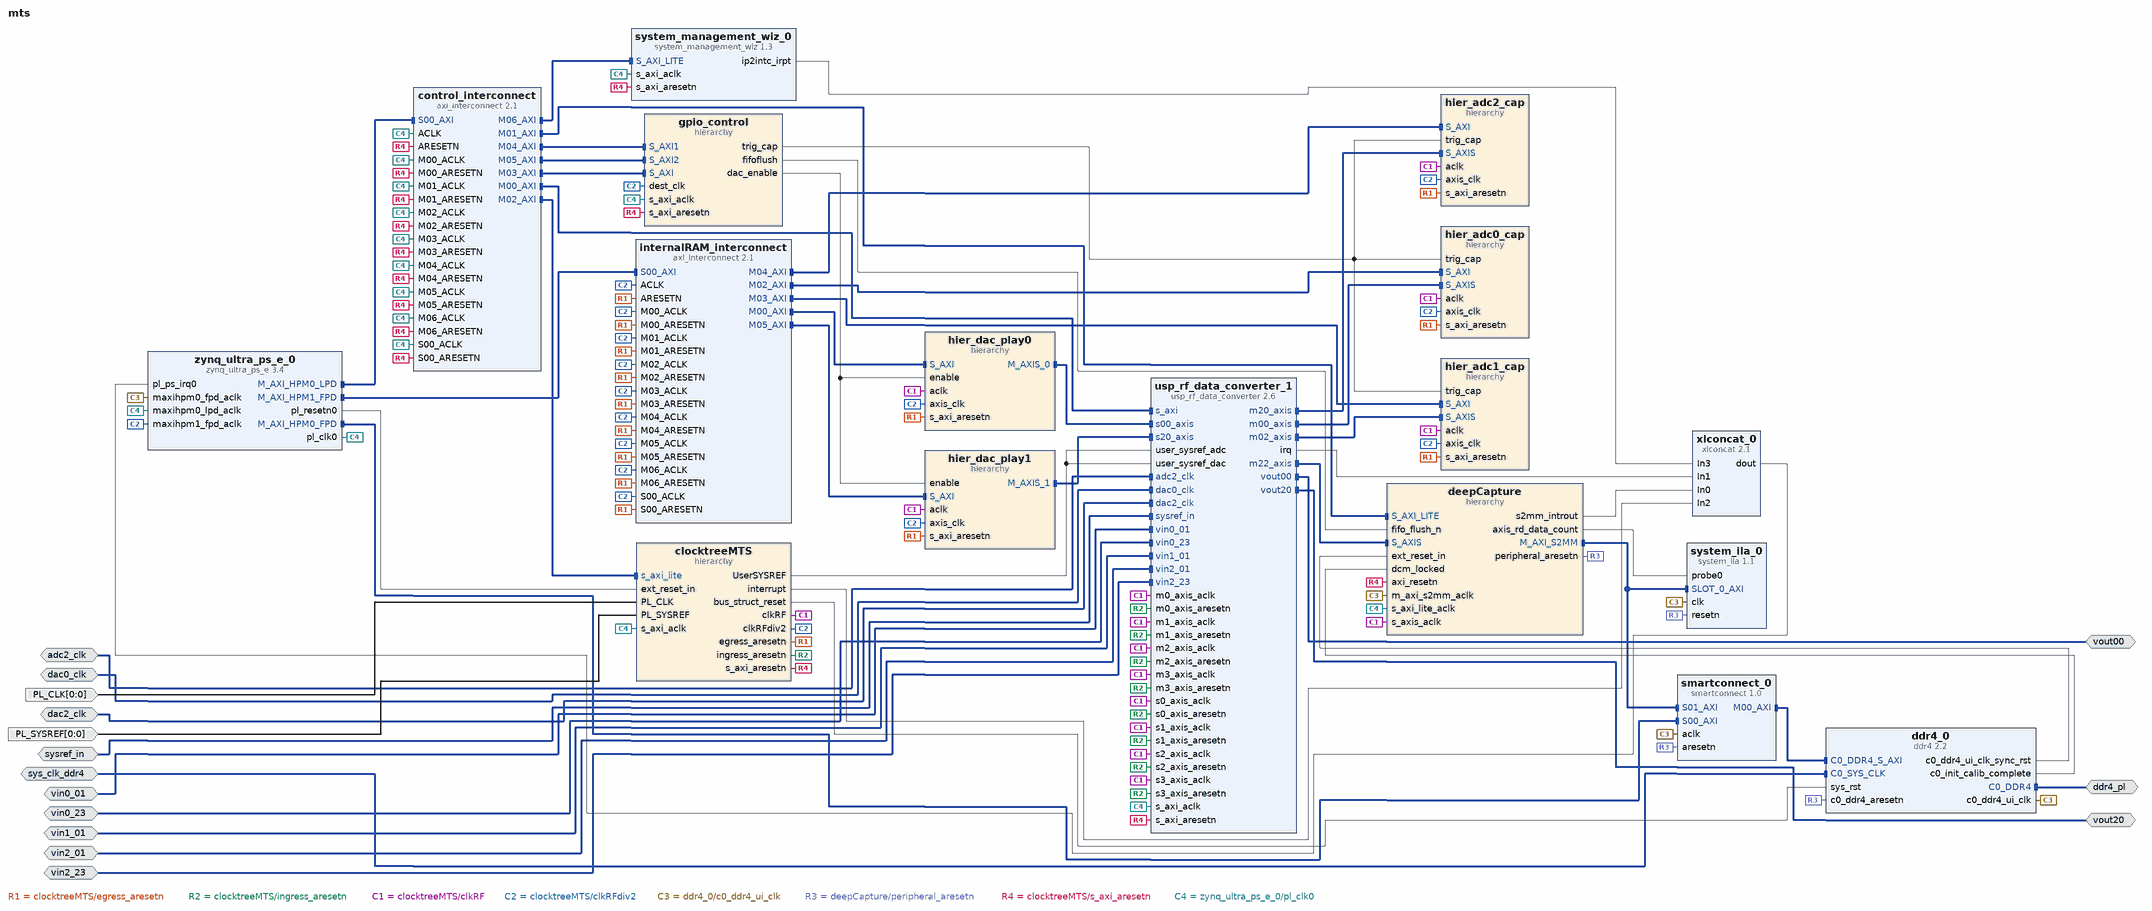
[diagram p0: block diagram of the top level]
# Vivado block design mts, xczu48dr-fsvg1517-2-e, Vivado 2022.1
create_bd_design mts

create_bd_intf_port -mode Slave -vlnv xilinx.com:interface:diff_clock_rtl:1.0 adc2_clk
create_bd_intf_port -mode Slave -vlnv xilinx.com:interface:diff_clock_rtl:1.0 dac2_clk
create_bd_intf_port -mode Master -vlnv xilinx.com:interface:ddr4_rtl:1.0 ddr4_pl
create_bd_intf_port -mode Slave -vlnv xilinx.com:interface:diff_clock_rtl:1.0 sys_clk_ddr4
set_property -dict {CONFIG.FREQ_HZ 200000000} [get_bd_intf_ports sys_clk_ddr4]
create_bd_intf_port -mode Slave -vlnv xilinx.com:display_usp_rf_data_converter:diff_pins_rtl:1.0 sysref_in
create_bd_intf_port -mode Slave -vlnv xilinx.com:interface:diff_analog_io_rtl:1.0 vin0_01
create_bd_intf_port -mode Slave -vlnv xilinx.com:interface:diff_analog_io_rtl:1.0 vin0_23
create_bd_intf_port -mode Slave -vlnv xilinx.com:interface:diff_analog_io_rtl:1.0 vin1_01
create_bd_intf_port -mode Slave -vlnv xilinx.com:interface:diff_analog_io_rtl:1.0 vin2_01
create_bd_intf_port -mode Slave -vlnv xilinx.com:interface:diff_analog_io_rtl:1.0 vin2_23
create_bd_intf_port -mode Master -vlnv xilinx.com:interface:diff_analog_io_rtl:1.0 vout00
create_bd_intf_port -mode Master -vlnv xilinx.com:interface:diff_analog_io_rtl:1.0 vout20
create_bd_intf_port -mode Slave -vlnv xilinx.com:interface:diff_clock_rtl:1.0 dac0_clk
create_bd_port -dir I -from 0 -to 0 -type clk PL_CLK
set_property -dict {CONFIG.FREQ_HZ 500000000} [get_bd_ports PL_CLK]
create_bd_port -dir I -from 0 -to 0 PL_SYSREF

create_bd_cell -type hier clocktreeMTS
create_bd_cell -type ip -vlnv xilinx.com:ip:axi_interconnect:2.1 control_interconnect
set_property -dict [list \
  CONFIG.NUM_MI 7 \
  CONFIG.S00_HAS_DATA_FIFO 0 \
  CONFIG.S00_HAS_REGSLICE 3 \
  CONFIG.STRATEGY 1 \
] [get_bd_cells control_interconnect]
create_bd_cell -type ip -vlnv xilinx.com:ip:ddr4:2.2 ddr4_0
set_property -dict [list \
  CONFIG.C0.BANK_GROUP_WIDTH 1 \
  CONFIG.C0.DDR4_AxiAddressWidth 32 \
  CONFIG.C0.DDR4_AxiDataWidth 512 \
  CONFIG.C0.DDR4_CasLatency 19 \
  CONFIG.C0.DDR4_CasWriteLatency 14 \
  CONFIG.C0.DDR4_DataWidth 64 \
  CONFIG.C0.DDR4_InputClockPeriod 5000 \
  CONFIG.C0.DDR4_MemoryPart MT40A512M16LY-075 \
  CONFIG.C0.DDR4_TimePeriod 750 \
  CONFIG.C0.DDR4_isCustom false \
] [get_bd_cells ddr4_0]
create_bd_cell -type hier deepCapture
create_bd_cell -type hier gpio_control
create_bd_cell -type hier hier_adc0_cap
create_bd_cell -type hier hier_adc1_cap
create_bd_cell -type hier hier_adc2_cap
create_bd_cell -type hier hier_dac_play0
create_bd_cell -type ip -vlnv xilinx.com:ip:axi_interconnect:2.1 internalRAM_interconnect
set_property -dict [list \
  CONFIG.ENABLE_ADVANCED_OPTIONS 0 \
  CONFIG.M00_HAS_DATA_FIFO 0 \
  CONFIG.M00_HAS_REGSLICE 3 \
  CONFIG.M01_HAS_DATA_FIFO 0 \
  CONFIG.M01_HAS_REGSLICE 3 \
  CONFIG.M02_HAS_DATA_FIFO 0 \
  CONFIG.M02_HAS_REGSLICE 3 \
  CONFIG.M03_HAS_DATA_FIFO 0 \
  CONFIG.M03_HAS_REGSLICE 3 \
  CONFIG.M04_HAS_DATA_FIFO 0 \
  CONFIG.M04_HAS_REGSLICE 3 \
  CONFIG.NUM_MI 7 \
  CONFIG.S00_HAS_DATA_FIFO 0 \
  CONFIG.S00_HAS_REGSLICE 3 \
  CONFIG.STRATEGY 1 \
] [get_bd_cells internalRAM_interconnect]
create_bd_cell -type ip -vlnv xilinx.com:ip:smartconnect:1.0 smartconnect_0
create_bd_cell -type ip -vlnv xilinx.com:ip:system_ila:1.1 system_ila_0
set_property -dict [list \
  CONFIG.ALL_PROBE_SAME_MU_CNT 2 \
  CONFIG.C_EN_STRG_QUAL 1 \
  CONFIG.C_MON_TYPE MIX \
  CONFIG.C_PROBE0_MU_CNT 2 \
  CONFIG.C_PROBE0_TYPE 1 \
  CONFIG.C_SLOT_0_APC_EN 1 \
] [get_bd_cells system_ila_0]
create_bd_cell -type ip -vlnv xilinx.com:ip:system_management_wiz:1.3 system_management_wiz_0
set_property -dict [list \
  CONFIG.AVERAGE_ENABLE_TEMPERATURE true \
  CONFIG.AVERAGE_ENABLE_VBRAM true \
  CONFIG.AVERAGE_ENABLE_VCCAUX true \
  CONFIG.AVERAGE_ENABLE_VCCINT true \
  CONFIG.AVERAGE_ENABLE_VCCPSAUX true \
  CONFIG.AVERAGE_ENABLE_VCCPSINTFP true \
  CONFIG.AVERAGE_ENABLE_VCCPSINTLP true \
  CONFIG.CHANNEL_AVERAGING 256 \
  CONFIG.CHANNEL_ENABLE_VCCPSAUX true \
  CONFIG.CHANNEL_ENABLE_VCCPSINTFP true \
  CONFIG.CHANNEL_ENABLE_VCCPSINTLP true \
  CONFIG.CHANNEL_ENABLE_VREFN true \
  CONFIG.CHANNEL_ENABLE_VREFP true \
  CONFIG.ENABLE_VCCPSAUX_ALARM false \
  CONFIG.ENABLE_VCCPSINTFP_ALARM false \
  CONFIG.ENABLE_VCCPSINTLP_ALARM false \
  CONFIG.OT_ALARM false \
  CONFIG.USER_TEMP_ALARM false \
  CONFIG.VCCAUX_ALARM false \
  CONFIG.VCCINT_ALARM false \
] [get_bd_cells system_management_wiz_0]
create_bd_cell -type ip -vlnv xilinx.com:ip:usp_rf_data_converter:2.6 usp_rf_data_converter_1
set_property -dict [list \
  CONFIG.ADC0_Clock_Dist 0 \
  CONFIG.ADC0_Clock_Source 2 \
  CONFIG.ADC0_Multi_Tile_Sync true \
  CONFIG.ADC0_Outclk_Freq 250.000 \
  CONFIG.ADC0_PLL_Enable false \
  CONFIG.ADC0_Refclk_Freq 4000.000 \
  CONFIG.ADC0_Sampling_Rate 4.0 \
  CONFIG.ADC1_Clock_Dist 0 \
  CONFIG.ADC1_Clock_Source 2 \
  CONFIG.ADC1_Multi_Tile_Sync true \
  CONFIG.ADC1_Outclk_Freq 250.000 \
  CONFIG.ADC1_PLL_Enable false \
  CONFIG.ADC1_Refclk_Freq 4000.000 \
  CONFIG.ADC1_Sampling_Rate 4.0 \
  CONFIG.ADC2_Clock_Dist 2 \
  CONFIG.ADC2_Clock_Source 2 \
  CONFIG.ADC2_Multi_Tile_Sync true \
  CONFIG.ADC2_Outclk_Freq 250.000 \
  CONFIG.ADC2_PLL_Enable true \
  CONFIG.ADC2_Refclk_Freq 500.000 \
  CONFIG.ADC2_Sampling_Rate 4.0 \
  CONFIG.ADC3_Clock_Source 2 \
  CONFIG.ADC3_Outclk_Freq 250.000 \
  CONFIG.ADC3_PLL_Enable false \
  CONFIG.ADC3_Refclk_Freq 4000.000 \
  CONFIG.ADC3_Sampling_Rate 4.0 \
  CONFIG.ADC_Coarse_Mixer_Freq02 3 \
  CONFIG.ADC_Coarse_Mixer_Freq10 3 \
  CONFIG.ADC_Coarse_Mixer_Freq20 3 \
  CONFIG.ADC_Coarse_Mixer_Freq22 3 \
  CONFIG.ADC_Coarse_Mixer_Freq30 3 \
  CONFIG.ADC_Data_Width00 8 \
  CONFIG.ADC_Data_Width02 8 \
  CONFIG.ADC_Data_Width10 8 \
  CONFIG.ADC_Data_Width20 8 \
  CONFIG.ADC_Data_Width22 8 \
  CONFIG.ADC_Data_Width30 8 \
  CONFIG.ADC_Decimation_Mode00 1 \
  CONFIG.ADC_Decimation_Mode02 1 \
  CONFIG.ADC_Decimation_Mode10 1 \
  CONFIG.ADC_Decimation_Mode20 1 \
  CONFIG.ADC_Decimation_Mode22 1 \
  CONFIG.ADC_Decimation_Mode30 1 \
  CONFIG.ADC_Dither00 true \
  CONFIG.ADC_Dither10 true \
  CONFIG.ADC_Dither20 true \
  CONFIG.ADC_Dither30 true \
  CONFIG.ADC_Mixer_Type00 1 \
  CONFIG.ADC_Mixer_Type02 1 \
  CONFIG.ADC_Mixer_Type10 1 \
  CONFIG.ADC_Mixer_Type20 1 \
  CONFIG.ADC_Mixer_Type22 1 \
  CONFIG.ADC_Mixer_Type30 1 \
  CONFIG.ADC_OBS02 false \
  CONFIG.ADC_OBS22 false \
  CONFIG.ADC_RTS false \
  CONFIG.ADC_Slice00_Enable true \
  CONFIG.ADC_Slice02_Enable true \
  CONFIG.ADC_Slice10_Enable true \
  CONFIG.ADC_Slice12_Enable false \
  CONFIG.ADC_Slice20_Enable true \
  CONFIG.ADC_Slice22_Enable true \
  CONFIG.ADC_Slice30_Enable true \
  CONFIG.Axiclk_Freq 100.0 \
  CONFIG.DAC0_Clock_Dist 2 \
  CONFIG.DAC0_Clock_Source 4 \
  CONFIG.DAC0_Link_Coupling 1 \
  CONFIG.DAC0_Multi_Tile_Sync true \
  CONFIG.DAC0_Outclk_Freq 250.000 \
  CONFIG.DAC0_PLL_Enable true \
  CONFIG.DAC0_Refclk_Freq 250.000 \
  CONFIG.DAC0_Sampling_Rate 4 \
  CONFIG.DAC1_Clock_Source 6 \
  CONFIG.DAC1_Link_Coupling 1 \
  CONFIG.DAC1_Multi_Tile_Sync true \
  CONFIG.DAC1_Outclk_Freq 250.000 \
  CONFIG.DAC1_PLL_Enable false \
  CONFIG.DAC1_Refclk_Freq 4000.000 \
  CONFIG.DAC1_Sampling_Rate 4 \
  CONFIG.DAC2_Clock_Dist 2 \
  CONFIG.DAC2_Link_Coupling 1 \
  CONFIG.DAC2_Multi_Tile_Sync true \
  CONFIG.DAC2_Outclk_Freq 250.000 \
  CONFIG.DAC2_PLL_Enable true \
  CONFIG.DAC2_Refclk_Freq 250.000 \
  CONFIG.DAC2_Sampling_Rate 4 \
  CONFIG.DAC3_Clock_Source 6 \
  CONFIG.DAC3_Link_Coupling 1 \
  CONFIG.DAC3_Multi_Tile_Sync false \
  CONFIG.DAC3_Outclk_Freq 250.000 \
  CONFIG.DAC3_PLL_Enable false \
  CONFIG.DAC3_Refclk_Freq 4000.000 \
  CONFIG.DAC3_Sampling_Rate 4 \
  CONFIG.DAC_Coarse_Mixer_Freq00 3 \
  CONFIG.DAC_Coarse_Mixer_Freq10 3 \
  CONFIG.DAC_Coarse_Mixer_Freq20 3 \
  CONFIG.DAC_Coarse_Mixer_Freq30 3 \
  CONFIG.DAC_Data_Width00 8 \
  CONFIG.DAC_Data_Width10 8 \
  CONFIG.DAC_Data_Width20 8 \
  CONFIG.DAC_Data_Width30 8 \
  CONFIG.DAC_Interpolation_Mode00 1 \
  CONFIG.DAC_Interpolation_Mode10 1 \
  CONFIG.DAC_Interpolation_Mode20 1 \
  CONFIG.DAC_Interpolation_Mode30 1 \
  CONFIG.DAC_Mixer_Mode00 2 \
  CONFIG.DAC_Mixer_Type00 1 \
  CONFIG.DAC_Mixer_Type10 1 \
  CONFIG.DAC_Mixer_Type20 1 \
  CONFIG.DAC_Mixer_Type30 1 \
  CONFIG.DAC_Output_Current 0 \
  CONFIG.DAC_Slice00_Enable true \
  CONFIG.DAC_Slice02_Enable false \
  CONFIG.DAC_Slice10_Enable true \
  CONFIG.DAC_Slice12_Enable false \
  CONFIG.DAC_Slice20_Enable true \
  CONFIG.DAC_Slice22_Enable false \
  CONFIG.DAC_Slice30_Enable true \
  CONFIG.DAC_Slice32_Enable false \
  CONFIG.DAC_VOP_Mode 0 \
  CONFIG.RF_Analyzer 1 \
] [get_bd_cells usp_rf_data_converter_1]
create_bd_cell -type ip -vlnv xilinx.com:ip:xlconcat:2.1 xlconcat_0
set_property -dict {CONFIG.NUM_PORTS 4} [get_bd_cells xlconcat_0]
create_bd_cell -type ip -vlnv xilinx.com:ip:zynq_ultra_ps_e:3.4 zynq_ultra_ps_e_0
set_property -dict [list \
  CONFIG.CAN0_BOARD_INTERFACE custom \
  CONFIG.CAN1_BOARD_INTERFACE custom \
  CONFIG.CSU_BOARD_INTERFACE custom \
  CONFIG.DP_BOARD_INTERFACE custom \
  CONFIG.GEM0_BOARD_INTERFACE custom \
  CONFIG.GEM1_BOARD_INTERFACE custom \
  CONFIG.GEM2_BOARD_INTERFACE custom \
  CONFIG.GEM3_BOARD_INTERFACE custom \
  CONFIG.GPIO_BOARD_INTERFACE custom \
  CONFIG.IIC0_BOARD_INTERFACE custom \
  CONFIG.IIC1_BOARD_INTERFACE custom \
  CONFIG.NAND_BOARD_INTERFACE custom \
  CONFIG.PCIE_BOARD_INTERFACE custom \
  CONFIG.PJTAG_BOARD_INTERFACE custom \
  CONFIG.PMU_BOARD_INTERFACE custom \
  CONFIG.PSU_BANK_0_IO_STANDARD LVCMOS18 \
  CONFIG.PSU_BANK_1_IO_STANDARD LVCMOS18 \
  CONFIG.PSU_BANK_2_IO_STANDARD LVCMOS18 \
  CONFIG.PSU_BANK_3_IO_STANDARD LVCMOS33 \
  CONFIG.PSU_USB3__DUAL_CLOCK_ENABLE 1 \
  CONFIG.PSU__CAN1__PERIPHERAL__ENABLE 0 \
  CONFIG.PSU__CRF_APB__ACPU_CTRL__FREQMHZ 1200 \
  CONFIG.PSU__CRF_APB__ACPU_CTRL__SRCSEL APLL \
  CONFIG.PSU__CRF_APB__APLL_CTRL__SRCSEL PSS_REF_CLK \
  CONFIG.PSU__CRF_APB__DBG_FPD_CTRL__FREQMHZ 250 \
  CONFIG.PSU__CRF_APB__DBG_FPD_CTRL__SRCSEL IOPLL \
  CONFIG.PSU__CRF_APB__DBG_TRACE_CTRL__FREQMHZ 250 \
  CONFIG.PSU__CRF_APB__DBG_TRACE_CTRL__SRCSEL IOPLL \
  CONFIG.PSU__CRF_APB__DBG_TSTMP_CTRL__FREQMHZ 250 \
  CONFIG.PSU__CRF_APB__DBG_TSTMP_CTRL__SRCSEL IOPLL \
  CONFIG.PSU__CRF_APB__DDR_CTRL__FREQMHZ 1067 \
  CONFIG.PSU__CRF_APB__DDR_CTRL__SRCSEL DPLL \
  CONFIG.PSU__CRF_APB__DPDMA_REF_CTRL__FREQMHZ 600 \
  CONFIG.PSU__CRF_APB__DPDMA_REF_CTRL__SRCSEL APLL \
  CONFIG.PSU__CRF_APB__DPLL_CTRL__SRCSEL PSS_REF_CLK \
  CONFIG.PSU__CRF_APB__DP_AUDIO_REF_CTRL__SRCSEL RPLL \
  CONFIG.PSU__CRF_APB__DP_STC_REF_CTRL__SRCSEL RPLL \
  CONFIG.PSU__CRF_APB__DP_VIDEO_REF_CTRL__SRCSEL VPLL \
  CONFIG.PSU__CRF_APB__GDMA_REF_CTRL__FREQMHZ 600 \
  CONFIG.PSU__CRF_APB__GDMA_REF_CTRL__SRCSEL APLL \
  CONFIG.PSU__CRF_APB__GPU_REF_CTRL__FREQMHZ 500 \
  CONFIG.PSU__CRF_APB__GPU_REF_CTRL__SRCSEL IOPLL \
  CONFIG.PSU__CRF_APB__TOPSW_LSBUS_CTRL__FREQMHZ 100 \
  CONFIG.PSU__CRF_APB__TOPSW_LSBUS_CTRL__SRCSEL IOPLL \
  CONFIG.PSU__CRF_APB__TOPSW_MAIN_CTRL__FREQMHZ 533.33 \
  CONFIG.PSU__CRF_APB__TOPSW_MAIN_CTRL__SRCSEL DPLL \
  CONFIG.PSU__CRF_APB__VPLL_CTRL__SRCSEL PSS_REF_CLK \
  CONFIG.PSU__CRL_APB__ADMA_REF_CTRL__FREQMHZ 500 \
  CONFIG.PSU__CRL_APB__ADMA_REF_CTRL__SRCSEL IOPLL \
  CONFIG.PSU__CRL_APB__CAN1_REF_CTRL__FREQMHZ 100 \
  CONFIG.PSU__CRL_APB__CAN1_REF_CTRL__SRCSEL IOPLL \
  CONFIG.PSU__CRL_APB__CPU_R5_CTRL__FREQMHZ 500 \
  CONFIG.PSU__CRL_APB__CPU_R5_CTRL__SRCSEL IOPLL \
  CONFIG.PSU__CRL_APB__DBG_LPD_CTRL__FREQMHZ 250 \
  CONFIG.PSU__CRL_APB__DBG_LPD_CTRL__SRCSEL IOPLL \
  CONFIG.PSU__CRL_APB__GEM3_REF_CTRL__FREQMHZ 125 \
  CONFIG.PSU__CRL_APB__GEM3_REF_CTRL__SRCSEL IOPLL \
  CONFIG.PSU__CRL_APB__I2C0_REF_CTRL__FREQMHZ 100 \
  CONFIG.PSU__CRL_APB__I2C0_REF_CTRL__SRCSEL IOPLL \
  CONFIG.PSU__CRL_APB__I2C1_REF_CTRL__FREQMHZ 100 \
  CONFIG.PSU__CRL_APB__I2C1_REF_CTRL__SRCSEL IOPLL \
  CONFIG.PSU__CRL_APB__IOPLL_CTRL__SRCSEL PSS_REF_CLK \
  CONFIG.PSU__CRL_APB__IOU_SWITCH_CTRL__FREQMHZ 250 \
  CONFIG.PSU__CRL_APB__IOU_SWITCH_CTRL__SRCSEL IOPLL \
  CONFIG.PSU__CRL_APB__LPD_LSBUS_CTRL__FREQMHZ 100 \
  CONFIG.PSU__CRL_APB__LPD_LSBUS_CTRL__SRCSEL IOPLL \
  CONFIG.PSU__CRL_APB__LPD_SWITCH_CTRL__FREQMHZ 500 \
  CONFIG.PSU__CRL_APB__LPD_SWITCH_CTRL__SRCSEL IOPLL \
  CONFIG.PSU__CRL_APB__PCAP_CTRL__FREQMHZ 200 \
  CONFIG.PSU__CRL_APB__PCAP_CTRL__SRCSEL IOPLL \
  CONFIG.PSU__CRL_APB__PL0_REF_CTRL__FREQMHZ 100 \
  CONFIG.PSU__CRL_APB__PL0_REF_CTRL__SRCSEL IOPLL \
  CONFIG.PSU__CRL_APB__QSPI_REF_CTRL__FREQMHZ 125 \
  CONFIG.PSU__CRL_APB__QSPI_REF_CTRL__SRCSEL IOPLL \
  CONFIG.PSU__CRL_APB__RPLL_CTRL__SRCSEL PSS_REF_CLK \
  CONFIG.PSU__CRL_APB__SDIO1_REF_CTRL__FREQMHZ 200 \
  CONFIG.PSU__CRL_APB__SDIO1_REF_CTRL__SRCSEL IOPLL \
  CONFIG.PSU__CRL_APB__TIMESTAMP_REF_CTRL__FREQMHZ 100 \
  CONFIG.PSU__CRL_APB__TIMESTAMP_REF_CTRL__SRCSEL IOPLL \
  CONFIG.PSU__CRL_APB__UART0_REF_CTRL__FREQMHZ 100 \
  CONFIG.PSU__CRL_APB__UART0_REF_CTRL__SRCSEL IOPLL \
  CONFIG.PSU__CRL_APB__UART1_REF_CTRL__FREQMHZ 100 \
  CONFIG.PSU__CRL_APB__UART1_REF_CTRL__SRCSEL IOPLL \
  CONFIG.PSU__CRL_APB__USB0_BUS_REF_CTRL__FREQMHZ 250 \
  CONFIG.PSU__CRL_APB__USB0_BUS_REF_CTRL__SRCSEL IOPLL \
  CONFIG.PSU__CRL_APB__USB3_DUAL_REF_CTRL__FREQMHZ 20 \
  CONFIG.PSU__CRL_APB__USB3_DUAL_REF_CTRL__SRCSEL IOPLL \
  CONFIG.PSU__CRL_APB__USB3__ENABLE 1 \
  CONFIG.PSU__CSUPMU__PERIPHERAL__VALID 1 \
  CONFIG.PSU__DDRC__BUS_WIDTH {64 Bit} \
  CONFIG.PSU__DDRC__COMPONENTS UDIMM \
  CONFIG.PSU__DDRC__DEVICE_CAPACITY {8192 MBits} \
  CONFIG.PSU__DDRC__DRAM_WIDTH {16 Bits} \
  CONFIG.PSU__DDRC__ECC Disabled \
  CONFIG.PSU__DDRC__MEMORY_TYPE {DDR 4} \
  CONFIG.PSU__DDRC__SPEED_BIN DDR4_2133P \
  CONFIG.PSU__DDR_HIGH_ADDRESS_GUI_ENABLE 1 \
  CONFIG.PSU__DDR__INTERFACE__FREQMHZ 533.500 \
  CONFIG.PSU__DEVICE_TYPE RFSOC \
  CONFIG.PSU__DISPLAYPORT__LANE0__ENABLE 1 \
  CONFIG.PSU__DISPLAYPORT__LANE0__IO {GT Lane1} \
  CONFIG.PSU__DISPLAYPORT__LANE1__ENABLE 1 \
  CONFIG.PSU__DISPLAYPORT__LANE1__IO {GT Lane0} \
  CONFIG.PSU__DISPLAYPORT__PERIPHERAL__ENABLE 1 \
  CONFIG.PSU__DLL__ISUSED 1 \
  CONFIG.PSU__DPAUX__PERIPHERAL__ENABLE 1 \
  CONFIG.PSU__DPAUX__PERIPHERAL__IO {MIO 27 .. 30} \
  CONFIG.PSU__DP__LANE_SEL {Dual Lower} \
  CONFIG.PSU__DP__REF_CLK_FREQ 27 \
  CONFIG.PSU__DP__REF_CLK_SEL {Ref Clk1} \
  CONFIG.PSU__ENET3__FIFO__ENABLE 0 \
  CONFIG.PSU__ENET3__GRP_MDIO__ENABLE 1 \
  CONFIG.PSU__ENET3__GRP_MDIO__IO {MIO 76 .. 77} \
  CONFIG.PSU__ENET3__PERIPHERAL__ENABLE 1 \
  CONFIG.PSU__ENET3__PERIPHERAL__IO {MIO 64 .. 75} \
  CONFIG.PSU__ENET3__PTP__ENABLE 0 \
  CONFIG.PSU__ENET3__TSU__ENABLE 0 \
  CONFIG.PSU__FPGA_PL0_ENABLE 1 \
  CONFIG.PSU__GEM3_COHERENCY 0 \
  CONFIG.PSU__GEM3_ROUTE_THROUGH_FPD 0 \
  CONFIG.PSU__GEM__TSU__ENABLE 0 \
  CONFIG.PSU__GPIO0_MIO__IO {MIO 0 .. 25} \
  CONFIG.PSU__GPIO0_MIO__PERIPHERAL__ENABLE 1 \
  CONFIG.PSU__GPIO1_MIO__IO {MIO 26 .. 51} \
  CONFIG.PSU__GPIO1_MIO__PERIPHERAL__ENABLE 1 \
  CONFIG.PSU__GPU_PP0__POWER__ON 0 \
  CONFIG.PSU__GPU_PP1__POWER__ON 0 \
  CONFIG.PSU__GT__LINK_SPEED HBR \
  CONFIG.PSU__GT__PRE_EMPH_LVL_4 0 \
  CONFIG.PSU__GT__VLT_SWNG_LVL_4 0 \
  CONFIG.PSU__I2C0__PERIPHERAL__ENABLE 1 \
  CONFIG.PSU__I2C0__PERIPHERAL__IO {MIO 14 .. 15} \
  CONFIG.PSU__I2C1__PERIPHERAL__ENABLE 1 \
  CONFIG.PSU__I2C1__PERIPHERAL__IO {MIO 16 .. 17} \
  CONFIG.PSU__IOU_SLCR__IOU_TTC_APB_CLK__TTC0_SEL APB \
  CONFIG.PSU__IOU_SLCR__IOU_TTC_APB_CLK__TTC1_SEL APB \
  CONFIG.PSU__IOU_SLCR__IOU_TTC_APB_CLK__TTC2_SEL APB \
  CONFIG.PSU__IOU_SLCR__IOU_TTC_APB_CLK__TTC3_SEL APB \
  CONFIG.PSU__MAXIGP0__DATA_WIDTH 128 \
  CONFIG.PSU__OVERRIDE_HPX_QOS 0 \
  CONFIG.PSU__OVERRIDE__BASIC_CLOCK 0 \
  CONFIG.PSU__PMU_COHERENCY 0 \
  CONFIG.PSU__PMU__AIBACK__ENABLE 0 \
  CONFIG.PSU__PMU__EMIO_GPI__ENABLE 0 \
  CONFIG.PSU__PMU__EMIO_GPO__ENABLE 0 \
  CONFIG.PSU__PMU__GPI0__ENABLE 0 \
  CONFIG.PSU__PMU__GPI1__ENABLE 0 \
  CONFIG.PSU__PMU__GPI2__ENABLE 0 \
  CONFIG.PSU__PMU__GPI3__ENABLE 0 \
  CONFIG.PSU__PMU__GPI4__ENABLE 0 \
  CONFIG.PSU__PMU__GPI5__ENABLE 0 \
  CONFIG.PSU__PMU__GPO0__ENABLE 1 \
  CONFIG.PSU__PMU__GPO0__IO {MIO 32} \
  CONFIG.PSU__PMU__GPO1__ENABLE 1 \
  CONFIG.PSU__PMU__GPO1__IO {MIO 33} \
  CONFIG.PSU__PMU__GPO2__ENABLE 1 \
  CONFIG.PSU__PMU__GPO2__IO {MIO 34} \
  CONFIG.PSU__PMU__GPO2__POLARITY low \
  CONFIG.PSU__PMU__GPO3__ENABLE 1 \
  CONFIG.PSU__PMU__GPO3__IO {MIO 35} \
  CONFIG.PSU__PMU__GPO3__POLARITY low \
  CONFIG.PSU__PMU__GPO4__ENABLE 1 \
  CONFIG.PSU__PMU__GPO4__IO {MIO 36} \
  CONFIG.PSU__PMU__GPO4__POLARITY low \
  CONFIG.PSU__PMU__GPO5__ENABLE 1 \
  CONFIG.PSU__PMU__GPO5__IO {MIO 37} \
  CONFIG.PSU__PMU__GPO5__POLARITY low \
  CONFIG.PSU__PMU__PERIPHERAL__ENABLE 1 \
  CONFIG.PSU__PMU__PLERROR__ENABLE 0 \
  CONFIG.PSU__PRESET_APPLIED 1 \
  CONFIG.PSU__PSS_REF_CLK__FREQMHZ 33.33333333333333333333333333333333333333333333333333 \
  CONFIG.PSU__QSPI_COHERENCY 0 \
  CONFIG.PSU__QSPI_ROUTE_THROUGH_FPD 0 \
  CONFIG.PSU__QSPI__GRP_FBCLK__ENABLE 1 \
  CONFIG.PSU__QSPI__GRP_FBCLK__IO {MIO 6} \
  CONFIG.PSU__QSPI__PERIPHERAL__DATA_MODE x4 \
  CONFIG.PSU__QSPI__PERIPHERAL__ENABLE 1 \
  CONFIG.PSU__QSPI__PERIPHERAL__IO {MIO 0 .. 12} \
  CONFIG.PSU__QSPI__PERIPHERAL__MODE {Dual Parallel} \
  CONFIG.PSU__SATA__LANE1__IO {GT Lane3} \
  CONFIG.PSU__SATA__PERIPHERAL__ENABLE 1 \
  CONFIG.PSU__SATA__REF_CLK_FREQ 125 \
  CONFIG.PSU__SATA__REF_CLK_SEL {Ref Clk3} \
  CONFIG.PSU__SD0__CLK_100_SDR_OTAP_DLY 0x3 \
  CONFIG.PSU__SD0__CLK_200_SDR_OTAP_DLY 0x3 \
  CONFIG.PSU__SD0__CLK_50_DDR_ITAP_DLY 0x3D \
  CONFIG.PSU__SD0__CLK_50_DDR_OTAP_DLY 0x4 \
  CONFIG.PSU__SD0__CLK_50_SDR_ITAP_DLY 0x15 \
  CONFIG.PSU__SD0__CLK_50_SDR_OTAP_DLY 0x5 \
  CONFIG.PSU__SD1_COHERENCY 0 \
  CONFIG.PSU__SD1_ROUTE_THROUGH_FPD 0 \
  CONFIG.PSU__SD1__CLK_100_SDR_OTAP_DLY 0x3 \
  CONFIG.PSU__SD1__CLK_200_SDR_OTAP_DLY 0x3 \
  CONFIG.PSU__SD1__CLK_50_DDR_ITAP_DLY 0x3D \
  CONFIG.PSU__SD1__CLK_50_DDR_OTAP_DLY 0x4 \
  CONFIG.PSU__SD1__CLK_50_SDR_ITAP_DLY 0x15 \
  CONFIG.PSU__SD1__CLK_50_SDR_OTAP_DLY 0x5 \
  CONFIG.PSU__SD1__DATA_TRANSFER_MODE 8Bit \
  CONFIG.PSU__SD1__GRP_CD__ENABLE 1 \
  CONFIG.PSU__SD1__GRP_CD__IO {MIO 45} \
  CONFIG.PSU__SD1__GRP_POW__ENABLE 0 \
  CONFIG.PSU__SD1__GRP_WP__ENABLE 0 \
  CONFIG.PSU__SD1__PERIPHERAL__ENABLE 1 \
  CONFIG.PSU__SD1__PERIPHERAL__IO {MIO 39 .. 51} \
  CONFIG.PSU__SD1__SLOT_TYPE {SD 3.0} \
  CONFIG.PSU__SWDT0__CLOCK__ENABLE 0 \
  CONFIG.PSU__SWDT0__PERIPHERAL__ENABLE 1 \
  CONFIG.PSU__SWDT0__RESET__ENABLE 0 \
  CONFIG.PSU__SWDT1__CLOCK__ENABLE 0 \
  CONFIG.PSU__SWDT1__PERIPHERAL__ENABLE 1 \
  CONFIG.PSU__SWDT1__RESET__ENABLE 0 \
  CONFIG.PSU__TSU__BUFG_PORT_PAIR 0 \
  CONFIG.PSU__TTC0__CLOCK__ENABLE 0 \
  CONFIG.PSU__TTC0__PERIPHERAL__ENABLE 1 \
  CONFIG.PSU__TTC0__WAVEOUT__ENABLE 0 \
  CONFIG.PSU__TTC1__CLOCK__ENABLE 0 \
  CONFIG.PSU__TTC1__PERIPHERAL__ENABLE 1 \
  CONFIG.PSU__TTC1__WAVEOUT__ENABLE 0 \
  CONFIG.PSU__TTC2__CLOCK__ENABLE 0 \
  CONFIG.PSU__TTC2__PERIPHERAL__ENABLE 1 \
  CONFIG.PSU__TTC2__WAVEOUT__ENABLE 0 \
  CONFIG.PSU__TTC3__CLOCK__ENABLE 0 \
  CONFIG.PSU__TTC3__PERIPHERAL__ENABLE 1 \
  CONFIG.PSU__TTC3__WAVEOUT__ENABLE 0 \
  CONFIG.PSU__UART0__BAUD_RATE 115200 \
  CONFIG.PSU__UART0__MODEM__ENABLE 0 \
  CONFIG.PSU__UART0__PERIPHERAL__ENABLE 1 \
  CONFIG.PSU__UART0__PERIPHERAL__IO {MIO 18 .. 19} \
  CONFIG.PSU__UART1__PERIPHERAL__ENABLE 0 \
  CONFIG.PSU__USB0_COHERENCY 0 \
  CONFIG.PSU__USB0__PERIPHERAL__ENABLE 1 \
  CONFIG.PSU__USB0__PERIPHERAL__IO {MIO 52 .. 63} \
  CONFIG.PSU__USB0__REF_CLK_FREQ 26 \
  CONFIG.PSU__USB0__REF_CLK_SEL {Ref Clk2} \
  CONFIG.PSU__USB2_0__EMIO__ENABLE 0 \
  CONFIG.PSU__USB3_0__EMIO__ENABLE 0 \
  CONFIG.PSU__USB3_0__PERIPHERAL__ENABLE 1 \
  CONFIG.PSU__USB3_0__PERIPHERAL__IO {GT Lane2} \
  CONFIG.PSU__USB__RESET__MODE {Boot Pin} \
  CONFIG.PSU__USB__RESET__POLARITY {Active Low} \
  CONFIG.PSU__USE__IRQ0 1 \
  CONFIG.PSU__USE__M_AXI_GP0 1 \
  CONFIG.PSU__USE__M_AXI_GP1 1 \
  CONFIG.PSU__USE__M_AXI_GP2 1 \
  CONFIG.QSPI_BOARD_INTERFACE custom \
  CONFIG.SATA_BOARD_INTERFACE custom \
  CONFIG.SD0_BOARD_INTERFACE custom \
  CONFIG.SD1_BOARD_INTERFACE custom \
  CONFIG.SPI0_BOARD_INTERFACE custom \
  CONFIG.SPI1_BOARD_INTERFACE custom \
  CONFIG.SUBPRESET1 Custom \
  CONFIG.SUBPRESET2 Custom \
  CONFIG.SWDT0_BOARD_INTERFACE custom \
  CONFIG.SWDT1_BOARD_INTERFACE custom \
  CONFIG.TRACE_BOARD_INTERFACE custom \
  CONFIG.TTC0_BOARD_INTERFACE custom \
  CONFIG.TTC1_BOARD_INTERFACE custom \
  CONFIG.TTC2_BOARD_INTERFACE custom \
  CONFIG.TTC3_BOARD_INTERFACE custom \
  CONFIG.UART0_BOARD_INTERFACE custom \
  CONFIG.UART1_BOARD_INTERFACE custom \
  CONFIG.USB0_BOARD_INTERFACE custom \
  CONFIG.USB1_BOARD_INTERFACE custom \
  CONFIG.preset None \
] [get_bd_cells zynq_ultra_ps_e_0]
# 736 more settings of zynq_ultra_ps_e_0 are not shown: defaults, MIO pin electricals, DDR timing, and values the tool derives
create_bd_cell -type hier hier_dac_play1

# ---- hierarchy /clocktreeMTS ----
current_bd_instance /clocktreeMTS
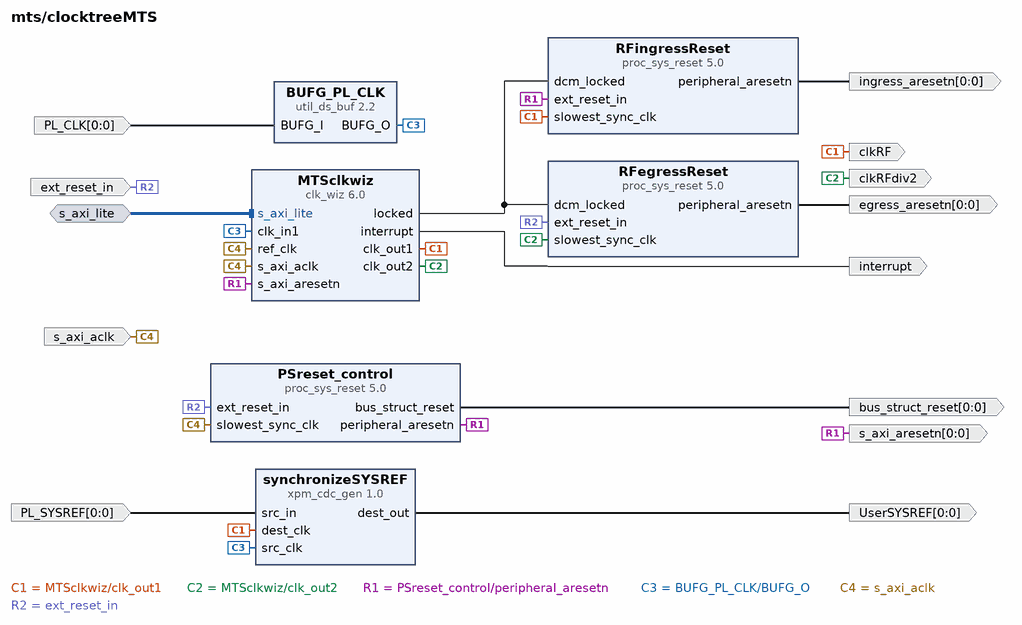
[diagram p1: block diagram inside /clocktreeMTS]
create_bd_intf_pin -mode Slave -vlnv xilinx.com:interface:aximm_rtl:1.0 s_axi_lite
create_bd_pin -dir I -from 0 -to 0 -type clk PL_CLK
create_bd_pin -dir I -from 0 -to 0 PL_SYSREF
create_bd_pin -dir O -from 0 -to 0 UserSYSREF
create_bd_pin -dir O -from 0 -to 0 -type rst bus_struct_reset
create_bd_pin -dir O -type clk clkRF
create_bd_pin -dir O -type clk clkRFdiv2
create_bd_pin -dir O -from 0 -to 0 -type rst egress_aresetn
create_bd_pin -dir I -type rst ext_reset_in
create_bd_pin -dir O -from 0 -to 0 -type rst ingress_aresetn
create_bd_pin -dir O -type intr interrupt
create_bd_pin -dir I -type clk s_axi_aclk
create_bd_pin -dir O -from 0 -to 0 -type rst s_axi_aresetn

create_bd_cell -type ip -vlnv xilinx.com:ip:util_ds_buf:2.2 BUFG_PL_CLK
set_property -dict {CONFIG.C_BUF_TYPE BUFG} [get_bd_cells BUFG_PL_CLK]
create_bd_cell -type ip -vlnv xilinx.com:ip:clk_wiz:6.0 MTSclkwiz
set_property -dict [list \
  CONFIG.AUTO_PRIMITIVE MMCM \
  CONFIG.CLKIN1_JITTER_PS 0.10 \
  CONFIG.CLKIN1_UI_JITTER 0.10 \
  CONFIG.CLKIN2_JITTER_PS 100.000 \
  CONFIG.CLKIN2_UI_JITTER 100.000 \
  CONFIG.CLKOUT1_DRIVES Buffer \
  CONFIG.CLKOUT1_JITTER 68.289 \
  CONFIG.CLKOUT1_MATCHED_ROUTING true \
  CONFIG.CLKOUT1_PHASE_ERROR 66.020 \
  CONFIG.CLKOUT1_REQUESTED_OUT_FREQ 500.0 \
  CONFIG.CLKOUT2_DRIVES Buffer \
  CONFIG.CLKOUT2_JITTER 78.335 \
  CONFIG.CLKOUT2_MATCHED_ROUTING true \
  CONFIG.CLKOUT2_PHASE_ERROR 66.020 \
  CONFIG.CLKOUT2_REQUESTED_OUT_FREQ 250.0 \
  CONFIG.CLKOUT2_USED true \
  CONFIG.CLKOUT3_DRIVES Buffer \
  CONFIG.CLKOUT4_DRIVES Buffer \
  CONFIG.CLKOUT5_DRIVES Buffer \
  CONFIG.CLKOUT6_DRIVES Buffer \
  CONFIG.CLKOUT7_DRIVES Buffer \
  CONFIG.ENABLE_CLOCK_MONITOR true \
  CONFIG.FEEDBACK_SOURCE FDBK_AUTO \
  CONFIG.JITTER_OPTIONS PS \
  CONFIG.JITTER_SEL Min_O_Jitter \
  CONFIG.MMCM_BANDWIDTH HIGH \
  CONFIG.MMCM_CLKFBOUT_MULT_F 3.000 \
  CONFIG.MMCM_CLKIN1_PERIOD 2.000 \
  CONFIG.MMCM_CLKIN2_PERIOD 10.0 \
  CONFIG.MMCM_CLKOUT0_DIVIDE_F 3.000 \
  CONFIG.MMCM_CLKOUT1_DIVIDE 6 \
  CONFIG.MMCM_COMPENSATION AUTO \
  CONFIG.MMCM_DIVCLK_DIVIDE 1 \
  CONFIG.MMCM_REF_JITTER1 0.000 \
  CONFIG.MMCM_REF_JITTER2 0.010 \
  CONFIG.NUM_OUT_CLKS 2 \
  CONFIG.OPTIMIZE_CLOCKING_STRUCTURE_EN false \
  CONFIG.PRIMITIVE MMCM \
  CONFIG.PRIM_IN_FREQ 500.0 \
  CONFIG.PRIM_SOURCE Global_buffer \
  CONFIG.SECONDARY_SOURCE Single_ended_clock_capable_pin \
  CONFIG.USE_LOCKED true \
  CONFIG.USE_PHASE_ALIGNMENT true \
  CONFIG.USE_RESET true \
] [get_bd_cells MTSclkwiz]
create_bd_cell -type ip -vlnv xilinx.com:ip:proc_sys_reset:5.0 PSreset_control
create_bd_cell -type ip -vlnv xilinx.com:ip:proc_sys_reset:5.0 RFegressReset
create_bd_cell -type ip -vlnv xilinx.com:ip:proc_sys_reset:5.0 RFingressReset
create_bd_cell -type ip -vlnv xilinx.com:ip:xpm_cdc_gen:1.0 synchronizeSYSREF
set_property -dict [list \
  CONFIG.CDC_TYPE xpm_cdc_single \
  CONFIG.DEST_SYNC_FF 2 \
  CONFIG.INIT_SYNC_FF true \
  CONFIG.WIDTH 1 \
] [get_bd_cells synchronizeSYSREF]

# ---- hierarchy /deepCapture ----
current_bd_instance /deepCapture
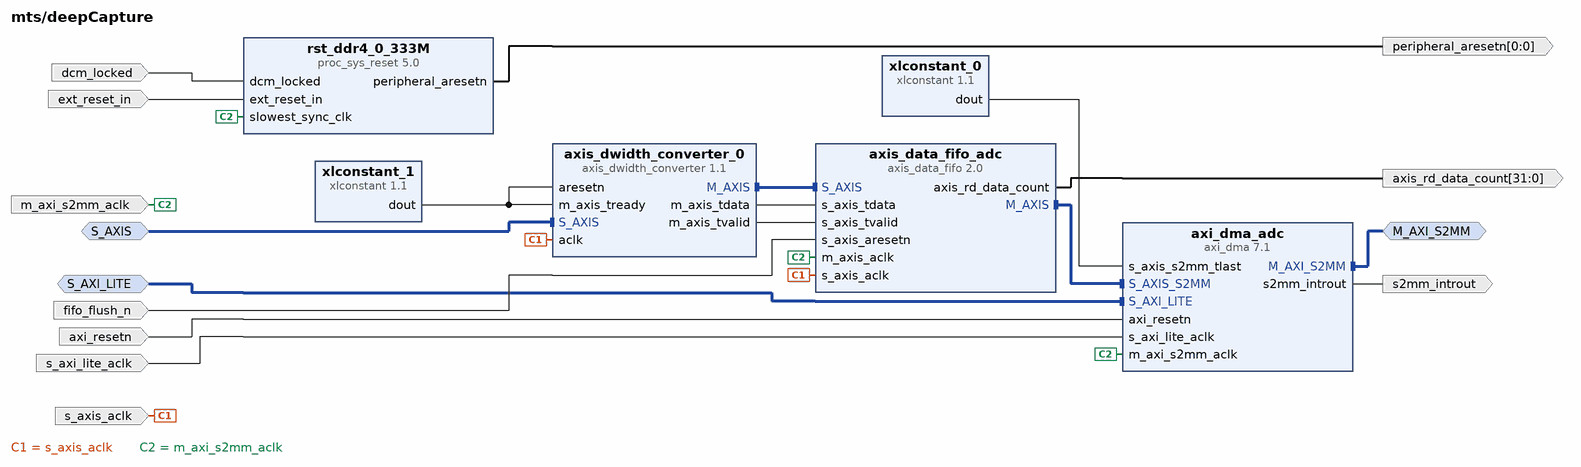
[diagram p2: block diagram inside /deepCapture]
create_bd_intf_pin -mode Master -vlnv xilinx.com:interface:aximm_rtl:1.0 M_AXI_S2MM
create_bd_intf_pin -mode Slave -vlnv xilinx.com:interface:axis_rtl:1.0 S_AXIS
create_bd_intf_pin -mode Slave -vlnv xilinx.com:interface:aximm_rtl:1.0 S_AXI_LITE
create_bd_pin -dir I -type rst axi_resetn
create_bd_pin -dir O -from 31 -to 0 axis_rd_data_count
create_bd_pin -dir I dcm_locked
create_bd_pin -dir I -type rst ext_reset_in
create_bd_pin -dir I -type rst fifo_flush_n
create_bd_pin -dir I -type clk m_axi_s2mm_aclk
create_bd_pin -dir O -from 0 -to 0 -type rst peripheral_aresetn
create_bd_pin -dir O -type intr s2mm_introut
create_bd_pin -dir I -type clk s_axi_lite_aclk
create_bd_pin -dir I -type clk s_axis_aclk

create_bd_cell -type ip -vlnv xilinx.com:ip:axi_dma:7.1 axi_dma_adc
set_property -dict [list \
  CONFIG.c_addr_width 40 \
  CONFIG.c_include_mm2s 0 \
  CONFIG.c_include_s2mm 1 \
  CONFIG.c_include_sg 0 \
  CONFIG.c_m_axi_s2mm_data_width 512 \
  CONFIG.c_s2mm_burst_size 64 \
  CONFIG.c_sg_length_width 26 \
] [get_bd_cells axi_dma_adc]
create_bd_cell -type ip -vlnv xilinx.com:ip:axis_data_fifo:2.0 axis_data_fifo_adc
set_property -dict [list \
  CONFIG.FIFO_DEPTH 1024 \
  CONFIG.FIFO_MODE 1 \
  CONFIG.HAS_RD_DATA_COUNT 1 \
  CONFIG.HAS_TKEEP 0 \
  CONFIG.HAS_TLAST 0 \
  CONFIG.HAS_TSTRB 0 \
  CONFIG.HAS_WR_DATA_COUNT 1 \
  CONFIG.IS_ACLK_ASYNC 1 \
  CONFIG.SYNCHRONIZATION_STAGES 2 \
  CONFIG.TDEST_WIDTH 0 \
  CONFIG.TID_WIDTH 0 \
  CONFIG.TUSER_WIDTH 0 \
] [get_bd_cells axis_data_fifo_adc]
create_bd_cell -type ip -vlnv xilinx.com:ip:axis_dwidth_converter:1.1 axis_dwidth_converter_0
set_property -dict [list \
  CONFIG.HAS_MI_TKEEP 0 \
  CONFIG.M_TDATA_NUM_BYTES 32 \
  CONFIG.S_TDATA_NUM_BYTES 16 \
] [get_bd_cells axis_dwidth_converter_0]
create_bd_cell -type ip -vlnv xilinx.com:ip:proc_sys_reset:5.0 rst_ddr4_0_333M
create_bd_cell -type ip -vlnv xilinx.com:ip:xlconstant:1.1 xlconstant_0
set_property -dict {CONFIG.CONST_VAL 0} [get_bd_cells xlconstant_0]
create_bd_cell -type ip -vlnv xilinx.com:ip:xlconstant:1.1 xlconstant_1

# ---- hierarchy /gpio_control ----
current_bd_instance /gpio_control
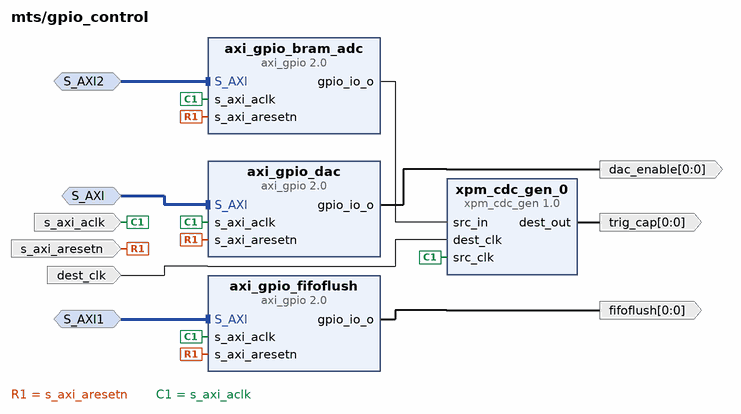
[diagram p3: block diagram inside /gpio_control]
create_bd_intf_pin -mode Slave -vlnv xilinx.com:interface:aximm_rtl:1.0 S_AXI
create_bd_intf_pin -mode Slave -vlnv xilinx.com:interface:aximm_rtl:1.0 S_AXI1
create_bd_intf_pin -mode Slave -vlnv xilinx.com:interface:aximm_rtl:1.0 S_AXI2
create_bd_pin -dir O -from 0 -to 0 dac_enable
create_bd_pin -dir I -type clk dest_clk
create_bd_pin -dir O -from 0 -to 0 fifoflush
create_bd_pin -dir I -type clk s_axi_aclk
create_bd_pin -dir I -type rst s_axi_aresetn
create_bd_pin -dir O -from 0 -to 0 trig_cap

create_bd_cell -type ip -vlnv xilinx.com:ip:axi_gpio:2.0 axi_gpio_bram_adc
set_property -dict {CONFIG.C_ALL_OUTPUTS 1 CONFIG.C_GPIO_WIDTH 1} [get_bd_cells axi_gpio_bram_adc]
create_bd_cell -type ip -vlnv xilinx.com:ip:axi_gpio:2.0 axi_gpio_dac
set_property -dict {CONFIG.C_ALL_OUTPUTS 1 CONFIG.C_GPIO_WIDTH 1} [get_bd_cells axi_gpio_dac]
create_bd_cell -type ip -vlnv xilinx.com:ip:axi_gpio:2.0 axi_gpio_fifoflush
set_property -dict {CONFIG.C_ALL_OUTPUTS 1 CONFIG.C_GPIO_WIDTH 1} [get_bd_cells axi_gpio_fifoflush]
create_bd_cell -type ip -vlnv xilinx.com:ip:xpm_cdc_gen:1.0 xpm_cdc_gen_0
set_property -dict [list \
  CONFIG.CDC_TYPE xpm_cdc_single \
  CONFIG.DEST_SYNC_FF 2 \
  CONFIG.INIT_SYNC_FF true \
  CONFIG.SRC_INPUT_REG false \
  CONFIG.WIDTH 1 \
] [get_bd_cells xpm_cdc_gen_0]

# ---- hierarchy /hier_adc0_cap ----
current_bd_instance /hier_adc0_cap
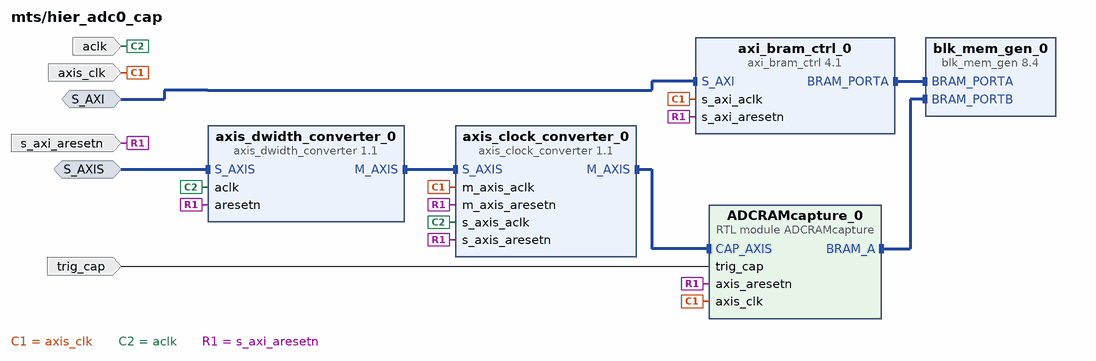
[diagram p4: block diagram inside /hier_adc0_cap]
create_bd_intf_pin -mode Slave -vlnv xilinx.com:interface:aximm_rtl:1.0 S_AXI
create_bd_intf_pin -mode Slave -vlnv xilinx.com:interface:axis_rtl:1.0 S_AXIS
create_bd_pin -dir I -type clk aclk
create_bd_pin -dir I -type clk axis_clk
create_bd_pin -dir I -type rst s_axi_aresetn
create_bd_pin -dir I trig_cap

create_bd_cell -type module -reference ADCRAMcapture ADCRAMcapture_0
set_property -dict {CONFIG.MEM_SIZE_BYTES 131072} [get_bd_cells ADCRAMcapture_0]
create_bd_cell -type ip -vlnv xilinx.com:ip:axi_bram_ctrl:4.1 axi_bram_ctrl_0
set_property -dict {CONFIG.DATA_WIDTH 256 CONFIG.READ_LATENCY 3 CONFIG.SINGLE_PORT_BRAM 1} [get_bd_cells axi_bram_ctrl_0]
create_bd_cell -type ip -vlnv xilinx.com:ip:axis_clock_converter:1.1 axis_clock_converter_0
set_property -dict {CONFIG.IS_ACLK_ASYNC 1} [get_bd_cells axis_clock_converter_0]
create_bd_cell -type ip -vlnv xilinx.com:ip:axis_dwidth_converter:1.1 axis_dwidth_converter_0
set_property -dict {CONFIG.M_TDATA_NUM_BYTES 32} [get_bd_cells axis_dwidth_converter_0]
create_bd_cell -type ip -vlnv xilinx.com:ip:blk_mem_gen:8.4 blk_mem_gen_0
set_property -dict [list \
  CONFIG.EN_SAFETY_CKT false \
  CONFIG.Memory_Type True_Dual_Port_RAM \
  CONFIG.Operating_Mode_A NO_CHANGE \
  CONFIG.PRIM_type_to_Implement URAM \
  CONFIG.Port_B_Clock 100 \
  CONFIG.Port_B_Enable_Rate 100 \
  CONFIG.Port_B_Write_Rate 50 \
  CONFIG.READ_LATENCY_A 3 \
  CONFIG.READ_LATENCY_B 3 \
] [get_bd_cells blk_mem_gen_0]

# ---- hierarchy /hier_adc1_cap ----
current_bd_instance /hier_adc1_cap
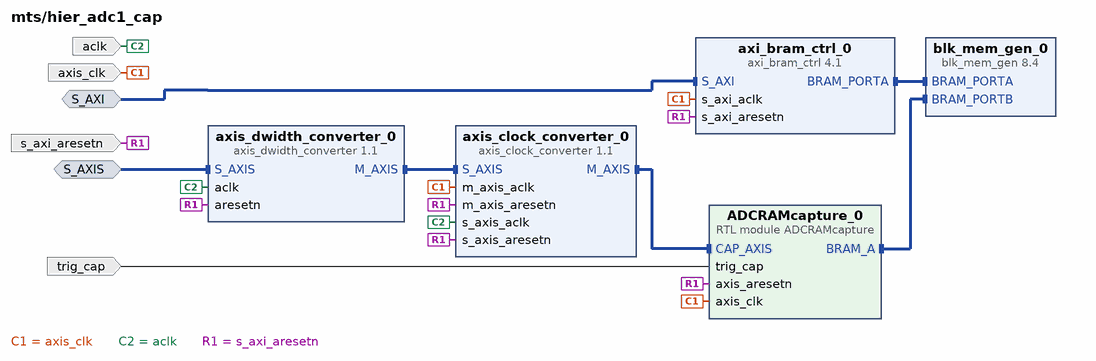
[diagram p5: block diagram inside /hier_adc1_cap]
create_bd_intf_pin -mode Slave -vlnv xilinx.com:interface:aximm_rtl:1.0 S_AXI
create_bd_intf_pin -mode Slave -vlnv xilinx.com:interface:axis_rtl:1.0 S_AXIS
create_bd_pin -dir I -type clk aclk
create_bd_pin -dir I -type clk axis_clk
create_bd_pin -dir I -type rst s_axi_aresetn
create_bd_pin -dir I trig_cap

create_bd_cell -type module -reference ADCRAMcapture ADCRAMcapture_0
set_property -dict {CONFIG.MEM_SIZE_BYTES 131072} [get_bd_cells ADCRAMcapture_0]
create_bd_cell -type ip -vlnv xilinx.com:ip:axi_bram_ctrl:4.1 axi_bram_ctrl_0
set_property -dict {CONFIG.DATA_WIDTH 256 CONFIG.READ_LATENCY 3 CONFIG.SINGLE_PORT_BRAM 1} [get_bd_cells axi_bram_ctrl_0]
create_bd_cell -type ip -vlnv xilinx.com:ip:axis_clock_converter:1.1 axis_clock_converter_0
set_property -dict {CONFIG.IS_ACLK_ASYNC 1} [get_bd_cells axis_clock_converter_0]
create_bd_cell -type ip -vlnv xilinx.com:ip:axis_dwidth_converter:1.1 axis_dwidth_converter_0
set_property -dict {CONFIG.M_TDATA_NUM_BYTES 32} [get_bd_cells axis_dwidth_converter_0]
create_bd_cell -type ip -vlnv xilinx.com:ip:blk_mem_gen:8.4 blk_mem_gen_0
set_property -dict [list \
  CONFIG.EN_SAFETY_CKT false \
  CONFIG.Memory_Type True_Dual_Port_RAM \
  CONFIG.Operating_Mode_A NO_CHANGE \
  CONFIG.PRIM_type_to_Implement URAM \
  CONFIG.Port_B_Clock 100 \
  CONFIG.Port_B_Enable_Rate 100 \
  CONFIG.Port_B_Write_Rate 50 \
  CONFIG.READ_LATENCY_A 3 \
  CONFIG.READ_LATENCY_B 3 \
] [get_bd_cells blk_mem_gen_0]

# ---- hierarchy /hier_adc2_cap ----
current_bd_instance /hier_adc2_cap
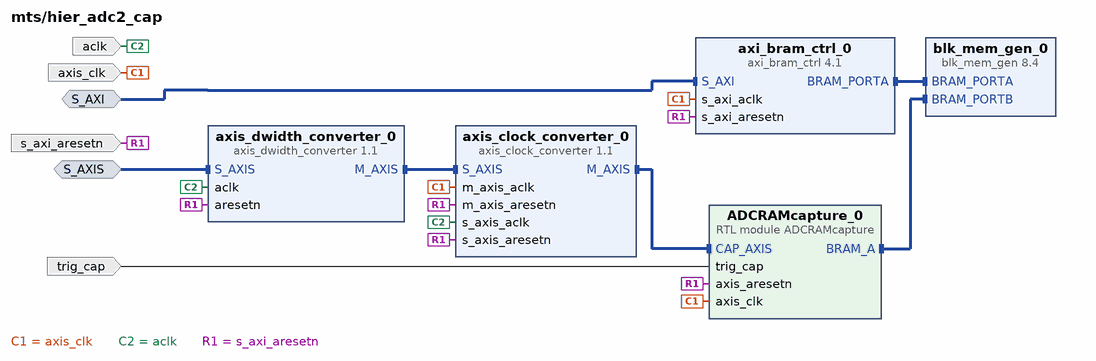
[diagram p6: block diagram inside /hier_adc2_cap]
create_bd_intf_pin -mode Slave -vlnv xilinx.com:interface:aximm_rtl:1.0 S_AXI
create_bd_intf_pin -mode Slave -vlnv xilinx.com:interface:axis_rtl:1.0 S_AXIS
create_bd_pin -dir I -type clk aclk
create_bd_pin -dir I -type clk axis_clk
create_bd_pin -dir I -type rst s_axi_aresetn
create_bd_pin -dir I trig_cap

create_bd_cell -type module -reference ADCRAMcapture ADCRAMcapture_0
set_property -dict {CONFIG.MEM_SIZE_BYTES 131072} [get_bd_cells ADCRAMcapture_0]
create_bd_cell -type ip -vlnv xilinx.com:ip:axi_bram_ctrl:4.1 axi_bram_ctrl_0
set_property -dict {CONFIG.DATA_WIDTH 256 CONFIG.READ_LATENCY 3 CONFIG.SINGLE_PORT_BRAM 1} [get_bd_cells axi_bram_ctrl_0]
create_bd_cell -type ip -vlnv xilinx.com:ip:axis_clock_converter:1.1 axis_clock_converter_0
set_property -dict {CONFIG.IS_ACLK_ASYNC 1} [get_bd_cells axis_clock_converter_0]
create_bd_cell -type ip -vlnv xilinx.com:ip:axis_dwidth_converter:1.1 axis_dwidth_converter_0
set_property -dict {CONFIG.M_TDATA_NUM_BYTES 32} [get_bd_cells axis_dwidth_converter_0]
create_bd_cell -type ip -vlnv xilinx.com:ip:blk_mem_gen:8.4 blk_mem_gen_0
set_property -dict [list \
  CONFIG.EN_SAFETY_CKT false \
  CONFIG.Memory_Type True_Dual_Port_RAM \
  CONFIG.Operating_Mode_A NO_CHANGE \
  CONFIG.PRIM_type_to_Implement URAM \
  CONFIG.Port_B_Clock 100 \
  CONFIG.Port_B_Enable_Rate 100 \
  CONFIG.Port_B_Write_Rate 50 \
  CONFIG.READ_LATENCY_A 3 \
  CONFIG.READ_LATENCY_B 3 \
] [get_bd_cells blk_mem_gen_0]

# ---- hierarchy /hier_dac_play0 ----
current_bd_instance /hier_dac_play0
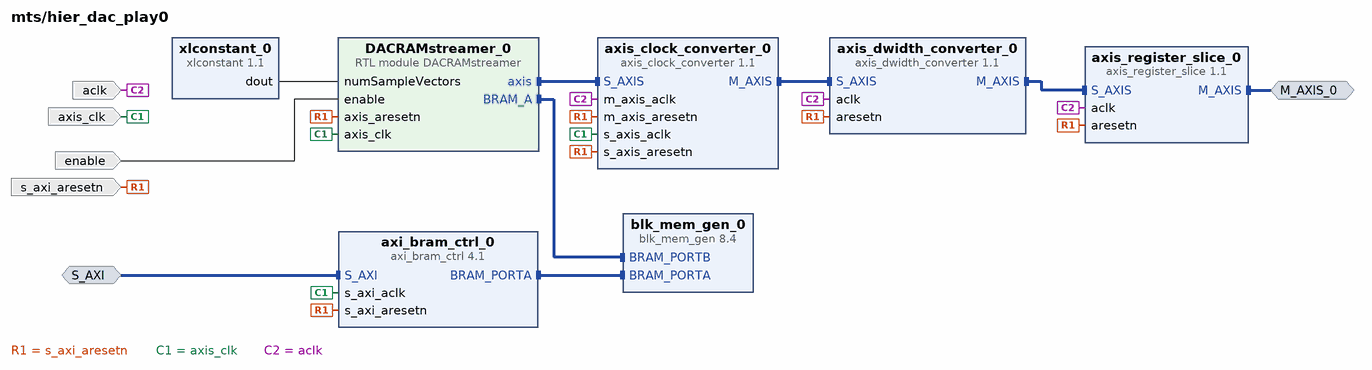
[diagram p7: block diagram inside /hier_dac_play0]
create_bd_intf_pin -mode Master -vlnv xilinx.com:interface:axis_rtl:1.0 M_AXIS_0
create_bd_intf_pin -mode Slave -vlnv xilinx.com:interface:aximm_rtl:1.0 S_AXI
create_bd_pin -dir I -type clk aclk
create_bd_pin -dir I -type clk axis_clk
create_bd_pin -dir I enable
create_bd_pin -dir I -type rst s_axi_aresetn

create_bd_cell -type module -reference DACRAMstreamer DACRAMstreamer_0
set_property -dict {CONFIG.MEM_SIZE_BYTES 131072} [get_bd_cells DACRAMstreamer_0]
create_bd_cell -type ip -vlnv xilinx.com:ip:axi_bram_ctrl:4.1 axi_bram_ctrl_0
set_property -dict {CONFIG.DATA_WIDTH 256 CONFIG.READ_LATENCY 3 CONFIG.SINGLE_PORT_BRAM 1} [get_bd_cells axi_bram_ctrl_0]
create_bd_cell -type ip -vlnv xilinx.com:ip:axis_clock_converter:1.1 axis_clock_converter_0
set_property -dict {CONFIG.IS_ACLK_ASYNC 1} [get_bd_cells axis_clock_converter_0]
create_bd_cell -type ip -vlnv xilinx.com:ip:axis_dwidth_converter:1.1 axis_dwidth_converter_0
set_property -dict {CONFIG.M_TDATA_NUM_BYTES 16} [get_bd_cells axis_dwidth_converter_0]
create_bd_cell -type ip -vlnv xilinx.com:ip:axis_register_slice:1.1 axis_register_slice_0
set_property -dict {CONFIG.REG_CONFIG 8} [get_bd_cells axis_register_slice_0]
create_bd_cell -type ip -vlnv xilinx.com:ip:blk_mem_gen:8.4 blk_mem_gen_0
set_property -dict [list \
  CONFIG.EN_SAFETY_CKT false \
  CONFIG.Memory_Type True_Dual_Port_RAM \
  CONFIG.Operating_Mode_A NO_CHANGE \
  CONFIG.PRIM_type_to_Implement URAM \
  CONFIG.Port_B_Clock 100 \
  CONFIG.Port_B_Enable_Rate 100 \
  CONFIG.Port_B_Write_Rate 50 \
  CONFIG.READ_LATENCY_A 3 \
  CONFIG.READ_LATENCY_B 3 \
] [get_bd_cells blk_mem_gen_0]
create_bd_cell -type ip -vlnv xilinx.com:ip:xlconstant:1.1 xlconstant_0
set_property -dict {CONFIG.CONST_VAL 0xFFF CONFIG.CONST_WIDTH 12} [get_bd_cells xlconstant_0]

# ---- hierarchy /hier_dac_play1 ----
current_bd_instance /hier_dac_play1
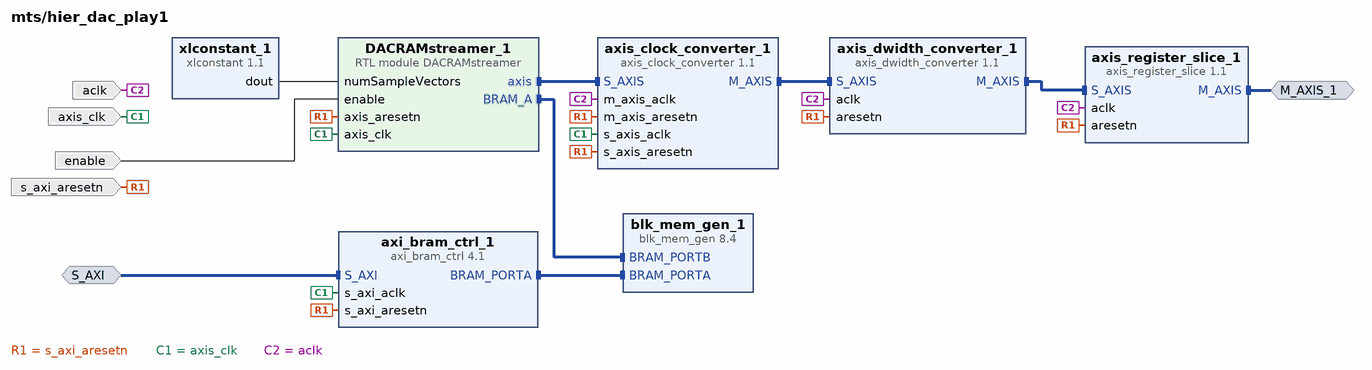
[diagram p8: block diagram inside /hier_dac_play1]
create_bd_intf_pin -mode Master -vlnv xilinx.com:interface:axis_rtl:1.0 M_AXIS_1
create_bd_intf_pin -mode Slave -vlnv xilinx.com:interface:aximm_rtl:1.0 S_AXI
create_bd_pin -dir I -type clk aclk
create_bd_pin -dir I -type clk axis_clk
create_bd_pin -dir I enable
create_bd_pin -dir I -type rst s_axi_aresetn

create_bd_cell -type module -reference DACRAMstreamer DACRAMstreamer_1
set_property -dict {CONFIG.MEM_SIZE_BYTES 131072} [get_bd_cells DACRAMstreamer_1]
create_bd_cell -type ip -vlnv xilinx.com:ip:axi_bram_ctrl:4.1 axi_bram_ctrl_1
set_property -dict {CONFIG.DATA_WIDTH 256 CONFIG.READ_LATENCY 3 CONFIG.SINGLE_PORT_BRAM 1} [get_bd_cells axi_bram_ctrl_1]
create_bd_cell -type ip -vlnv xilinx.com:ip:axis_clock_converter:1.1 axis_clock_converter_1
set_property -dict {CONFIG.IS_ACLK_ASYNC 1} [get_bd_cells axis_clock_converter_1]
create_bd_cell -type ip -vlnv xilinx.com:ip:axis_dwidth_converter:1.1 axis_dwidth_converter_1
set_property -dict {CONFIG.M_TDATA_NUM_BYTES 16} [get_bd_cells axis_dwidth_converter_1]
create_bd_cell -type ip -vlnv xilinx.com:ip:axis_register_slice:1.1 axis_register_slice_1
set_property -dict {CONFIG.REG_CONFIG 8} [get_bd_cells axis_register_slice_1]
create_bd_cell -type ip -vlnv xilinx.com:ip:blk_mem_gen:8.4 blk_mem_gen_1
set_property -dict [list \
  CONFIG.Memory_Type True_Dual_Port_RAM \
  CONFIG.PRIM_type_to_Implement URAM \
  CONFIG.Port_B_Clock 100 \
  CONFIG.Port_B_Enable_Rate 100 \
  CONFIG.Port_B_Write_Rate 50 \
  CONFIG.READ_LATENCY_A 3 \
  CONFIG.READ_LATENCY_B 3 \
  CONFIG.Use_RSTB_Pin true \
] [get_bd_cells blk_mem_gen_1]
create_bd_cell -type ip -vlnv xilinx.com:ip:xlconstant:1.1 xlconstant_1
set_property -dict {CONFIG.CONST_VAL 0xFFF CONFIG.CONST_WIDTH 12} [get_bd_cells xlconstant_1]

# ---- connections ----

current_bd_instance /clocktreeMTS
connect_bd_intf_net [get_bd_intf_pins s_axi_lite] [get_bd_intf_pins MTSclkwiz/s_axi_lite]
connect_bd_net -net BUFG_I_0_1 [get_bd_pins PL_CLK] [get_bd_pins BUFG_PL_CLK/BUFG_I]
connect_bd_net [get_bd_pins MTSclkwiz/interrupt] [get_bd_pins interrupt]
connect_bd_net [get_bd_pins PSreset_control/bus_struct_reset] [get_bd_pins bus_struct_reset]
connect_bd_net [get_bd_pins RFegressReset/peripheral_aresetn] [get_bd_pins egress_aresetn]
connect_bd_net [get_bd_pins RFingressReset/peripheral_aresetn] [get_bd_pins ingress_aresetn]
connect_bd_net -net clk_wiz_0_clk_out1 [get_bd_pins MTSclkwiz/clk_out1] \
  [get_bd_pins clkRF] [get_bd_pins RFingressReset/slowest_sync_clk] [get_bd_pins synchronizeSYSREF/dest_clk]
connect_bd_net -net clk_wiz_0_locked [get_bd_pins MTSclkwiz/locked] [get_bd_pins RFegressReset/dcm_locked] [get_bd_pins RFingressReset/dcm_locked]
connect_bd_net -net clk_wiz_adc0_clk_out2 [get_bd_pins MTSclkwiz/clk_out2] [get_bd_pins clkRFdiv2] [get_bd_pins RFegressReset/slowest_sync_clk]
connect_bd_net -net proc_sys_reset_0_peripheral_aresetn [get_bd_pins PSreset_control/peripheral_aresetn] \
  [get_bd_pins s_axi_aresetn] [get_bd_pins MTSclkwiz/s_axi_aresetn] [get_bd_pins RFingressReset/ext_reset_in]
connect_bd_net -net src_in_0_1 [get_bd_pins PL_SYSREF] [get_bd_pins synchronizeSYSREF/src_in]
connect_bd_net [get_bd_pins synchronizeSYSREF/dest_out] [get_bd_pins UserSYSREF]
connect_bd_net -net util_ds_buf_0_BUFG_O [get_bd_pins BUFG_PL_CLK/BUFG_O] [get_bd_pins MTSclkwiz/clk_in1] [get_bd_pins synchronizeSYSREF/src_clk]
connect_bd_net -net zynq_ultra_ps_e_0_pl_clk0 [get_bd_pins s_axi_aclk] \
  [get_bd_pins MTSclkwiz/ref_clk] [get_bd_pins MTSclkwiz/s_axi_aclk] [get_bd_pins PSreset_control/slowest_sync_clk]
connect_bd_net -net zynq_ultra_ps_e_0_pl_resetn0 [get_bd_pins ext_reset_in] \
  [get_bd_pins PSreset_control/ext_reset_in] [get_bd_pins RFegressReset/ext_reset_in]

current_bd_instance /deepCapture
connect_bd_intf_net [get_bd_intf_pins S_AXI_LITE] [get_bd_intf_pins axi_dma_adc/S_AXI_LITE]
connect_bd_intf_net [get_bd_intf_pins M_AXI_S2MM] [get_bd_intf_pins axi_dma_adc/M_AXI_S2MM]
connect_bd_intf_net [get_bd_intf_pins S_AXIS] [get_bd_intf_pins axis_dwidth_converter_0/S_AXIS]
connect_bd_intf_net [get_bd_intf_pins axi_dma_adc/S_AXIS_S2MM] [get_bd_intf_pins axis_data_fifo_adc/M_AXIS]
connect_bd_intf_net [get_bd_intf_pins axis_data_fifo_adc/S_AXIS] [get_bd_intf_pins axis_dwidth_converter_0/M_AXIS]
connect_bd_net [get_bd_pins axi_dma_adc/s2mm_introut] [get_bd_pins s2mm_introut]
connect_bd_net [get_bd_pins axi_resetn] [get_bd_pins axi_dma_adc/axi_resetn]
connect_bd_net [get_bd_pins axis_data_fifo_adc/axis_rd_data_count] [get_bd_pins axis_rd_data_count]
connect_bd_net [get_bd_pins axis_dwidth_converter_0/m_axis_tdata] [get_bd_pins axis_data_fifo_adc/s_axis_tdata]
connect_bd_net [get_bd_pins axis_dwidth_converter_0/m_axis_tvalid] [get_bd_pins axis_data_fifo_adc/s_axis_tvalid]
connect_bd_net -net clk_wiz_adc1_clk_out1 [get_bd_pins s_axis_aclk] \
  [get_bd_pins axis_data_fifo_adc/s_axis_aclk] [get_bd_pins axis_dwidth_converter_0/aclk]
connect_bd_net [get_bd_pins dcm_locked] [get_bd_pins rst_ddr4_0_333M/dcm_locked]
connect_bd_net -net ddr4_0_c0_ddr4_ui_clk [get_bd_pins m_axi_s2mm_aclk] \
  [get_bd_pins axi_dma_adc/m_axi_s2mm_aclk] [get_bd_pins axis_data_fifo_adc/m_axis_aclk] \
  [get_bd_pins rst_ddr4_0_333M/slowest_sync_clk]
connect_bd_net [get_bd_pins ext_reset_in] [get_bd_pins rst_ddr4_0_333M/ext_reset_in]
connect_bd_net [get_bd_pins rst_ddr4_0_333M/peripheral_aresetn] [get_bd_pins peripheral_aresetn]
connect_bd_net -net s_axis_aresetn_0_1 [get_bd_pins fifo_flush_n] [get_bd_pins axis_data_fifo_adc/s_axis_aresetn]
connect_bd_net [get_bd_pins xlconstant_0/dout] [get_bd_pins axi_dma_adc/s_axis_s2mm_tlast]
connect_bd_net [get_bd_pins xlconstant_1/dout] [get_bd_pins axis_dwidth_converter_0/aresetn] [get_bd_pins axis_dwidth_converter_0/m_axis_tready]
connect_bd_net -net zynq_ultra_ps_e_0_pl_clk0 [get_bd_pins s_axi_lite_aclk] [get_bd_pins axi_dma_adc/s_axi_lite_aclk]

current_bd_instance /gpio_control
connect_bd_intf_net [get_bd_intf_pins S_AXI] [get_bd_intf_pins axi_gpio_dac/S_AXI]
connect_bd_intf_net [get_bd_intf_pins S_AXI1] [get_bd_intf_pins axi_gpio_fifoflush/S_AXI]
connect_bd_intf_net [get_bd_intf_pins S_AXI2] [get_bd_intf_pins axi_gpio_bram_adc/S_AXI]
connect_bd_net -net axi_gpio_bram_cap_gpio_io_o [get_bd_pins axi_gpio_bram_adc/gpio_io_o] [get_bd_pins xpm_cdc_gen_0/src_in]
connect_bd_net [get_bd_pins axi_gpio_dac/gpio_io_o] [get_bd_pins dac_enable]
connect_bd_net -net axi_gpio_fifo_flush_gpio_io_o [get_bd_pins axi_gpio_fifoflush/gpio_io_o] [get_bd_pins fifoflush]
connect_bd_net [get_bd_pins dest_clk] [get_bd_pins xpm_cdc_gen_0/dest_clk]
connect_bd_net -net proc_sys_reset_0_peripheral_aresetn [get_bd_pins s_axi_aresetn] \
  [get_bd_pins axi_gpio_bram_adc/s_axi_aresetn] [get_bd_pins axi_gpio_dac/s_axi_aresetn] \
  [get_bd_pins axi_gpio_fifoflush/s_axi_aresetn]
connect_bd_net [get_bd_pins xpm_cdc_gen_0/dest_out] [get_bd_pins trig_cap]
connect_bd_net -net zynq_ultra_ps_e_0_pl_clk0 [get_bd_pins s_axi_aclk] \
  [get_bd_pins axi_gpio_bram_adc/s_axi_aclk] [get_bd_pins axi_gpio_dac/s_axi_aclk] \
  [get_bd_pins axi_gpio_fifoflush/s_axi_aclk] [get_bd_pins xpm_cdc_gen_0/src_clk]

current_bd_instance /hier_adc0_cap
connect_bd_intf_net [get_bd_intf_pins ADCRAMcapture_0/BRAM_A] [get_bd_intf_pins blk_mem_gen_0/BRAM_PORTB]
connect_bd_intf_net [get_bd_intf_pins axi_bram_ctrl_0/BRAM_PORTA] [get_bd_intf_pins blk_mem_gen_0/BRAM_PORTA]
connect_bd_intf_net [get_bd_intf_pins ADCRAMcapture_0/CAP_AXIS] [get_bd_intf_pins axis_clock_converter_0/M_AXIS]
connect_bd_intf_net [get_bd_intf_pins axis_clock_converter_0/S_AXIS] [get_bd_intf_pins axis_dwidth_converter_0/M_AXIS]
connect_bd_intf_net [get_bd_intf_pins S_AXI] [get_bd_intf_pins axi_bram_ctrl_0/S_AXI]
connect_bd_intf_net [get_bd_intf_pins S_AXIS] [get_bd_intf_pins axis_dwidth_converter_0/S_AXIS]
connect_bd_net [get_bd_pins axis_clk] \
  [get_bd_pins ADCRAMcapture_0/axis_clk] [get_bd_pins axi_bram_ctrl_0/s_axi_aclk] \
  [get_bd_pins axis_clock_converter_0/m_axis_aclk]
connect_bd_net -net clk_wiz_adc1_clk_out1 [get_bd_pins aclk] \
  [get_bd_pins axis_clock_converter_0/s_axis_aclk] [get_bd_pins axis_dwidth_converter_0/aclk]
connect_bd_net [get_bd_pins s_axi_aresetn] \
  [get_bd_pins ADCRAMcapture_0/axis_aresetn] [get_bd_pins axi_bram_ctrl_0/s_axi_aresetn] \
  [get_bd_pins axis_clock_converter_0/m_axis_aresetn] [get_bd_pins axis_clock_converter_0/s_axis_aresetn] \
  [get_bd_pins axis_dwidth_converter_0/aresetn]
connect_bd_net [get_bd_pins trig_cap] [get_bd_pins ADCRAMcapture_0/trig_cap]
